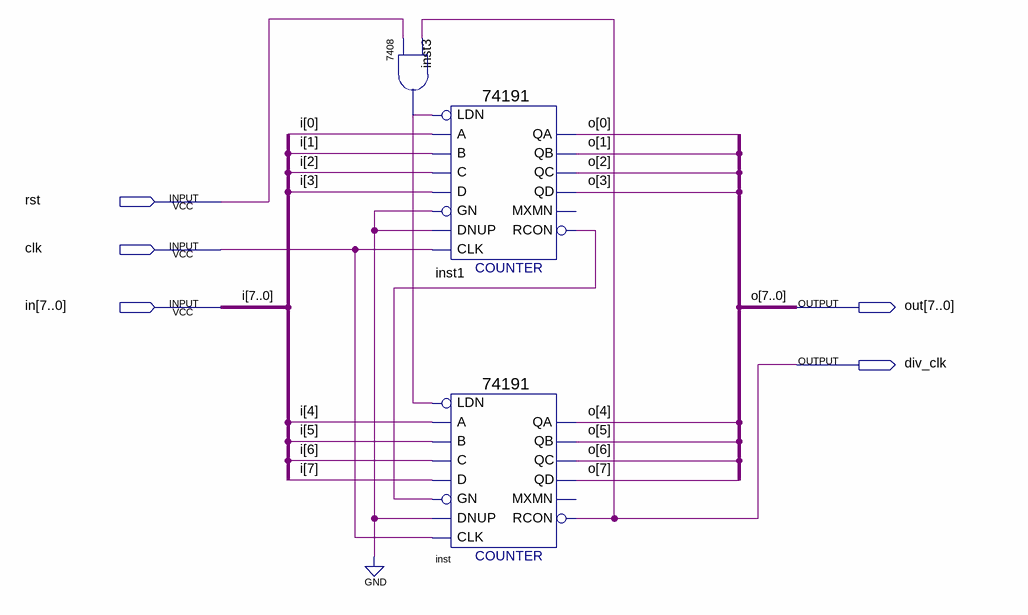
[diagram p0: schematic sheet]
// Quartus schematic frequencyDivider.bdf as structural Verilog: 3 symbols, 5 pins
module frequencyDivider (
  input  rst,
  input  clk,
  input  [7:0] in,
  output [7:0] out,
  output div_clk
);

  wire inst1_rcon, inst3_1;

  \7408  inst3 (.\3 (div_clk), .\2 (rst), .\1 (inst3_1));
  \74191  inst1 (
    .LDN(inst3_1), .D(in[3]), .C(in[2]), .B(in[1]), .A(in[0]), .CLK(clk), .DNUP(1'b0), .GN(1'b0),
    .RCON(inst1_rcon), .QA(out[0]), .QB(out[1]), .QD(out[3]), .QC(out[2]));  // open: MXMN
  \74191  inst (
    .LDN(inst3_1), .D(in[7]), .C(in[6]), .B(in[5]), .A(in[4]), .CLK(clk), .DNUP(1'b0), .GN(inst1_rcon),
    .RCON(div_clk), .QA(out[4]), .QB(out[5]), .QD(out[7]), .QC(out[6]));  // open: MXMN

  // Other names for the same wires on the sheet: i[7:0] = in; o[7:0] = out
endmodule
